# Altium project blacky_pcb.PrjPcb
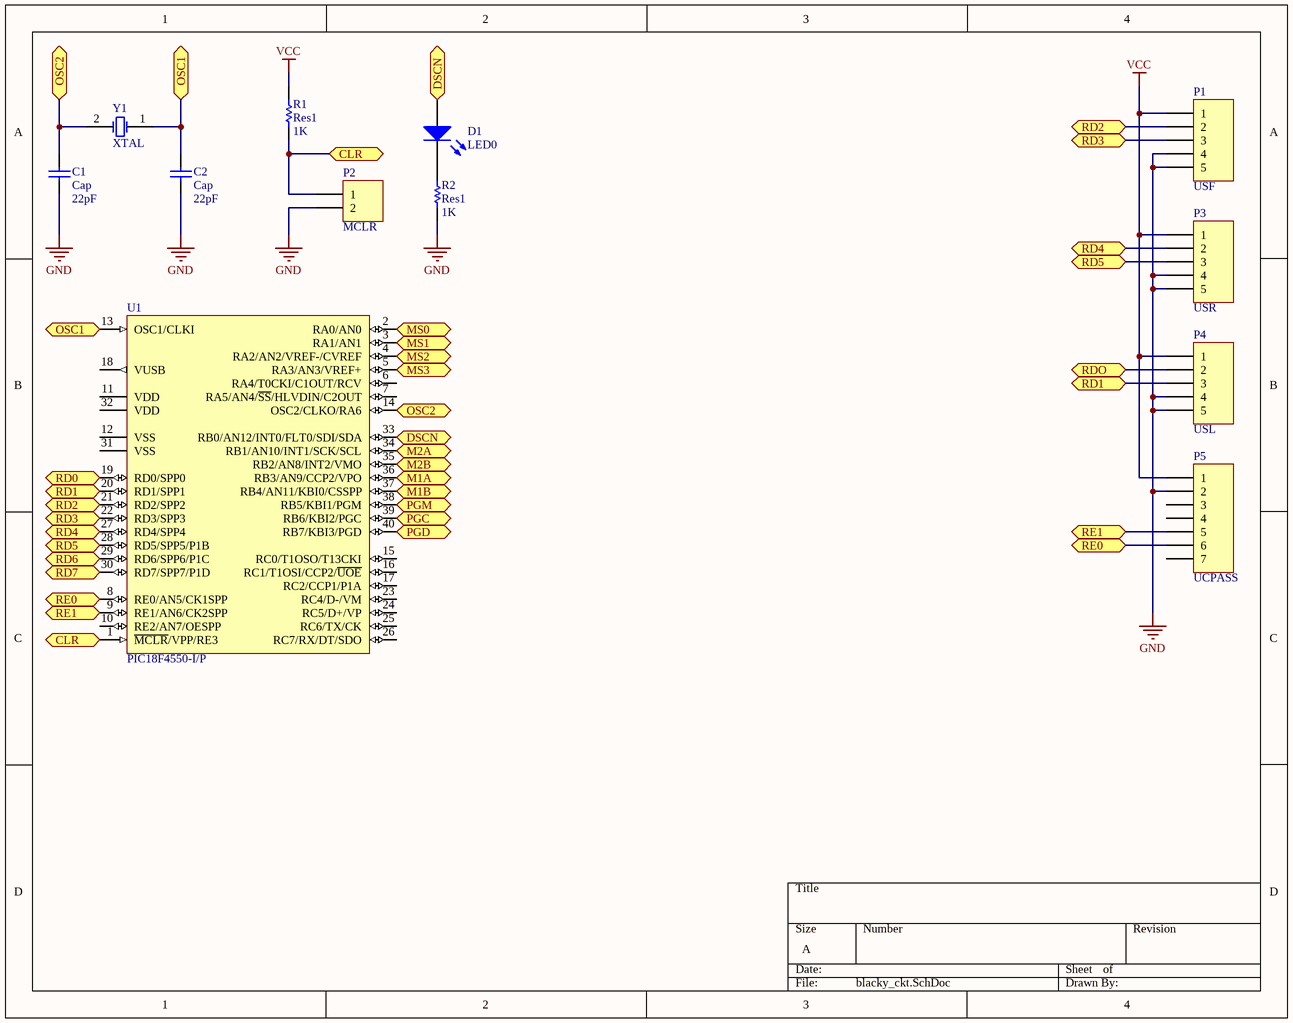
[diagram p0: blacky_ckt.SchDoc]
1 sheet, 12 parts. Net scope: flat (ports and power ports of the same name join across sheets).
Board file: blacky_pcb.PcbDoc

## Sheet blacky_ckt.SchDoc
size A

### Parts
C1  Cap  value 22pF  [RAD-0.3]
C2  Cap  value 22pF  [RAD-0.3]
D1  LED0  [LED-0]
P1  USF  [HDR1X5]
P2  MCLR  [HDR1X2]
P3  USR  [HDR1X5]
P4  USL  [HDR1X5]
P5  UCPASS  [HDR1X7]
R1  Res1  value 1K  [AXIAL-0.3]
R2  Res1  value 1K  [AXIAL-0.3]
U1  PIC18F4550-I/P  [PDIP600-P40]
Y1  XTAL  [R38]

### Ports
CLR (bidir), DSCN (bidir), M1A (bidir), M1B (bidir), M2A (bidir), M2B (bidir), MS0 (bidir), MS1 (bidir), MS2 (bidir), MS3 (bidir), OSC1 (bidir), OSC2 (bidir), PGC (bidir), PGD (bidir), PGM (bidir), RD0 (bidir), RD1 (bidir), RD2 (bidir), RD3 (bidir), RD4 (bidir), RD5 (bidir), RD6 (bidir), RD7 (bidir), RDO (bidir), RE0 (bidir), RE1 (bidir)

### Nets
GND: C1.1 C2.1 P1.4 P1.5 P2.2 P3.4 P3.5 P4.4 P4.5 P5.2 R2.1
VCC: P1.1 P3.1 P4.1 P5.1 R1.2
NetC1_2: C1.2 U1.14(OSC2/CLKO/RA6) Y1.2(OSC2) ; port OSC2
NetC2_2: C2.2 U1.13(OSC1/CLKI) Y1.1(OSC1) ; port OSC1
NetD1_1: D1.1(A) U1.33(RB0/AN12/INT0/FLT0/SDI/SDA) ; port DSCN
NetD1_2: D1.2(K) R2.2
NetP1_2: P1.2 U1.21(RD2/SPP2) ; port RD2
NetP1_3: P1.3 U1.22(RD3/SPP3) ; port RD3
NetP2_1: P2.1 R1.1 U1.1(~{MCLR}/VPP/RE3) ; port CLR
NetP3_2: P3.2 U1.27(RD4/SPP4) ; port RD4
NetP3_3: P3.3 U1.28(RD5/SPP5/P1B) ; port RD5
NetP4_2: P4.2 ; port RDO
NetP4_3: P4.3 U1.20(RD1/SPP1) ; port RD1
NetP5_5: P5.5 U1.9(RE1/AN6/CK2SPP) ; port RE1
NetP5_6: P5.6 U1.8(RE0/AN5/CK1SPP) ; port RE0
NetU1_2: U1.2(RA0/AN0) ; port MS0
NetU1_3: U1.3(RA1/AN1) ; port MS1
NetU1_4: U1.4(RA2/AN2/VREF-/CVREF) ; port MS2
NetU1_5: U1.5(RA3/AN3/VREF+) ; port MS3
NetU1_19: U1.19(RD0/SPP0) ; port RD0
NetU1_29: U1.29(RD6/SPP6/P1C) ; port RD6
NetU1_30: U1.30(RD7/SPP7/P1D) ; port RD7
NetU1_34: U1.34(RB1/AN10/INT1/SCK/SCL) ; port M2A
NetU1_35: U1.35(RB2/AN8/INT2/VMO) ; port M2B
NetU1_36: U1.36(RB3/AN9/CCP2/VPO) ; port M1A
NetU1_37: U1.37(RB4/AN11/KBI0/CSSPP) ; port M1B
NetU1_38: U1.38(RB5/KBI1/PGM) ; port PGM
NetU1_39: U1.39(RB6/KBI2/PGC) ; port PGC
NetU1_40: U1.40(RB7/KBI3/PGD) ; port PGD

Not connected (* = marked no-connect by the designer): P5 3 4 7; U1 6(RA4/T0CKI/C1OUT/RCV) 7(RA5/AN4/~{SS}/HLVDIN/C2OUT) 10(RE2/AN7/OESPP) 11(VDD) 12(VSS) 15(RC0/T1OSO/T13CKI) 16(RC1/T1OSI/CCP2/~{UOE}) 17(RC2/CCP1/P1A) 18(VUSB) 23(RC4/D-/VM) 24(RC5/D+/VP) 25(RC6/TX/CK) 26(RC7/RX/DT/SDO) 31(VSS) 32(VDD)

### Library data of the parts
C1 C2 = Cap: Capacitor; Published: 8-Jun-2000; LatestRevisionDate: 17-Jul-2002; LatestRevisionNote: Re-released for DXP Platform.; PackageReference: RAD-0.3; Publisher: Altium Limited; PackageDescription: Radial Cap, Thru-Hole; 2 Leads; 0.3 in Pin Spacing
D1 = LED0: Typical INFRARED GaAs LED; Published: 8-Jun-2000; LatestRevisionDate: 08-Jul-2005; LatestRevisionNote: Mech Layer 1 removed.; PackageReference: LED-0; Publisher: Altium Limited; PackageDescription: LED; 2 Leads
P1 P3 P4 = Header 5: Header, 5-Pin; LatestRevisionDate: 17-Jul-2002; LatestRevisionNote: Re-released for DXP Platform.; Publisher: Altium Limited
P2 = Header 2: Header, 2-Pin; LatestRevisionDate: 17-Jul-2002; LatestRevisionNote: Re-released for DXP Platform.; Publisher: Altium Limited
P5 = Header 7: Header, 7-Pin; LatestRevisionDate: 17-Jul-2002; LatestRevisionNote: Re-released for DXP Platform.; Publisher: Altium Limited
R1 R2 = Res1: Resistor; Published: 8-Jun-2000; LatestRevisionDate: 17-Jul-2002; LatestRevisionNote: Re-released for DXP Platform.; PackageReference: AXIAL-0.3; Publisher: Altium Limited; PackageDescription: Axial Device, Thru-Hole; 2 Leads; 0.3 in Pin Spacing
U1 = PIC18F4550-I/P: High Performance, Enhanced Flash, USB Microcontroller with nanoWatt Technology, 32K Flash, 40-Pin PDIP, Industrial Temperature Range; Published: 29-Jan-2009; LatestRevisionDate: 02-Dec-2009; LatestRevisionNote: Updated to datasheet revision E, Aug-2008; DatasheetVersion: revE, Aug-2008; PackageVersion: revBB, Aug-2009; PackageReference: PDIP600-P40; Publisher: Altium Limited; PackageDescription: 40-Lead Plastic Dual In-Line (P) - 600 mil Body [PDIP]; Supplier 1: Digi-Key; Supplier Part Number 1: PIC18F4550-I/P-ND; Supplier 2: Farnell; Supplier Part Number 2: 1660062; Supplier 3: Farnell; Supplier Part Number 3: 9321357; ComponentLink1Description: Datasheet; ComponentLink1URL: http://ww1.microchip.com/downloads/en/DeviceDoc/39632e.pdf; ComponentLink2Description: Packaging Specification; ComponentLink2URL: http://www.microchip.com/stellent/groups/techpub_sg/documents/packagingspec/en012702.pdf; ComponentLink3Description: Microchip.com Home; ComponentLink3URL: http://www.microchip.com/
Y1 = XTAL: Crystal Oscillator; Published: 8-Jun-2000; LatestRevisionDate: 17-Jul-2002; LatestRevisionNote: Re-released for DXP Platform.; PackageReference: R38; Publisher: Altium Limited; PackageDescription: Crystal, Thru-Hole; 2 Leads; Body 3.1 x 8.2 mm (Dia.xH)